# EAGLE design ADC3_60M (EAGLE 9.6.2)
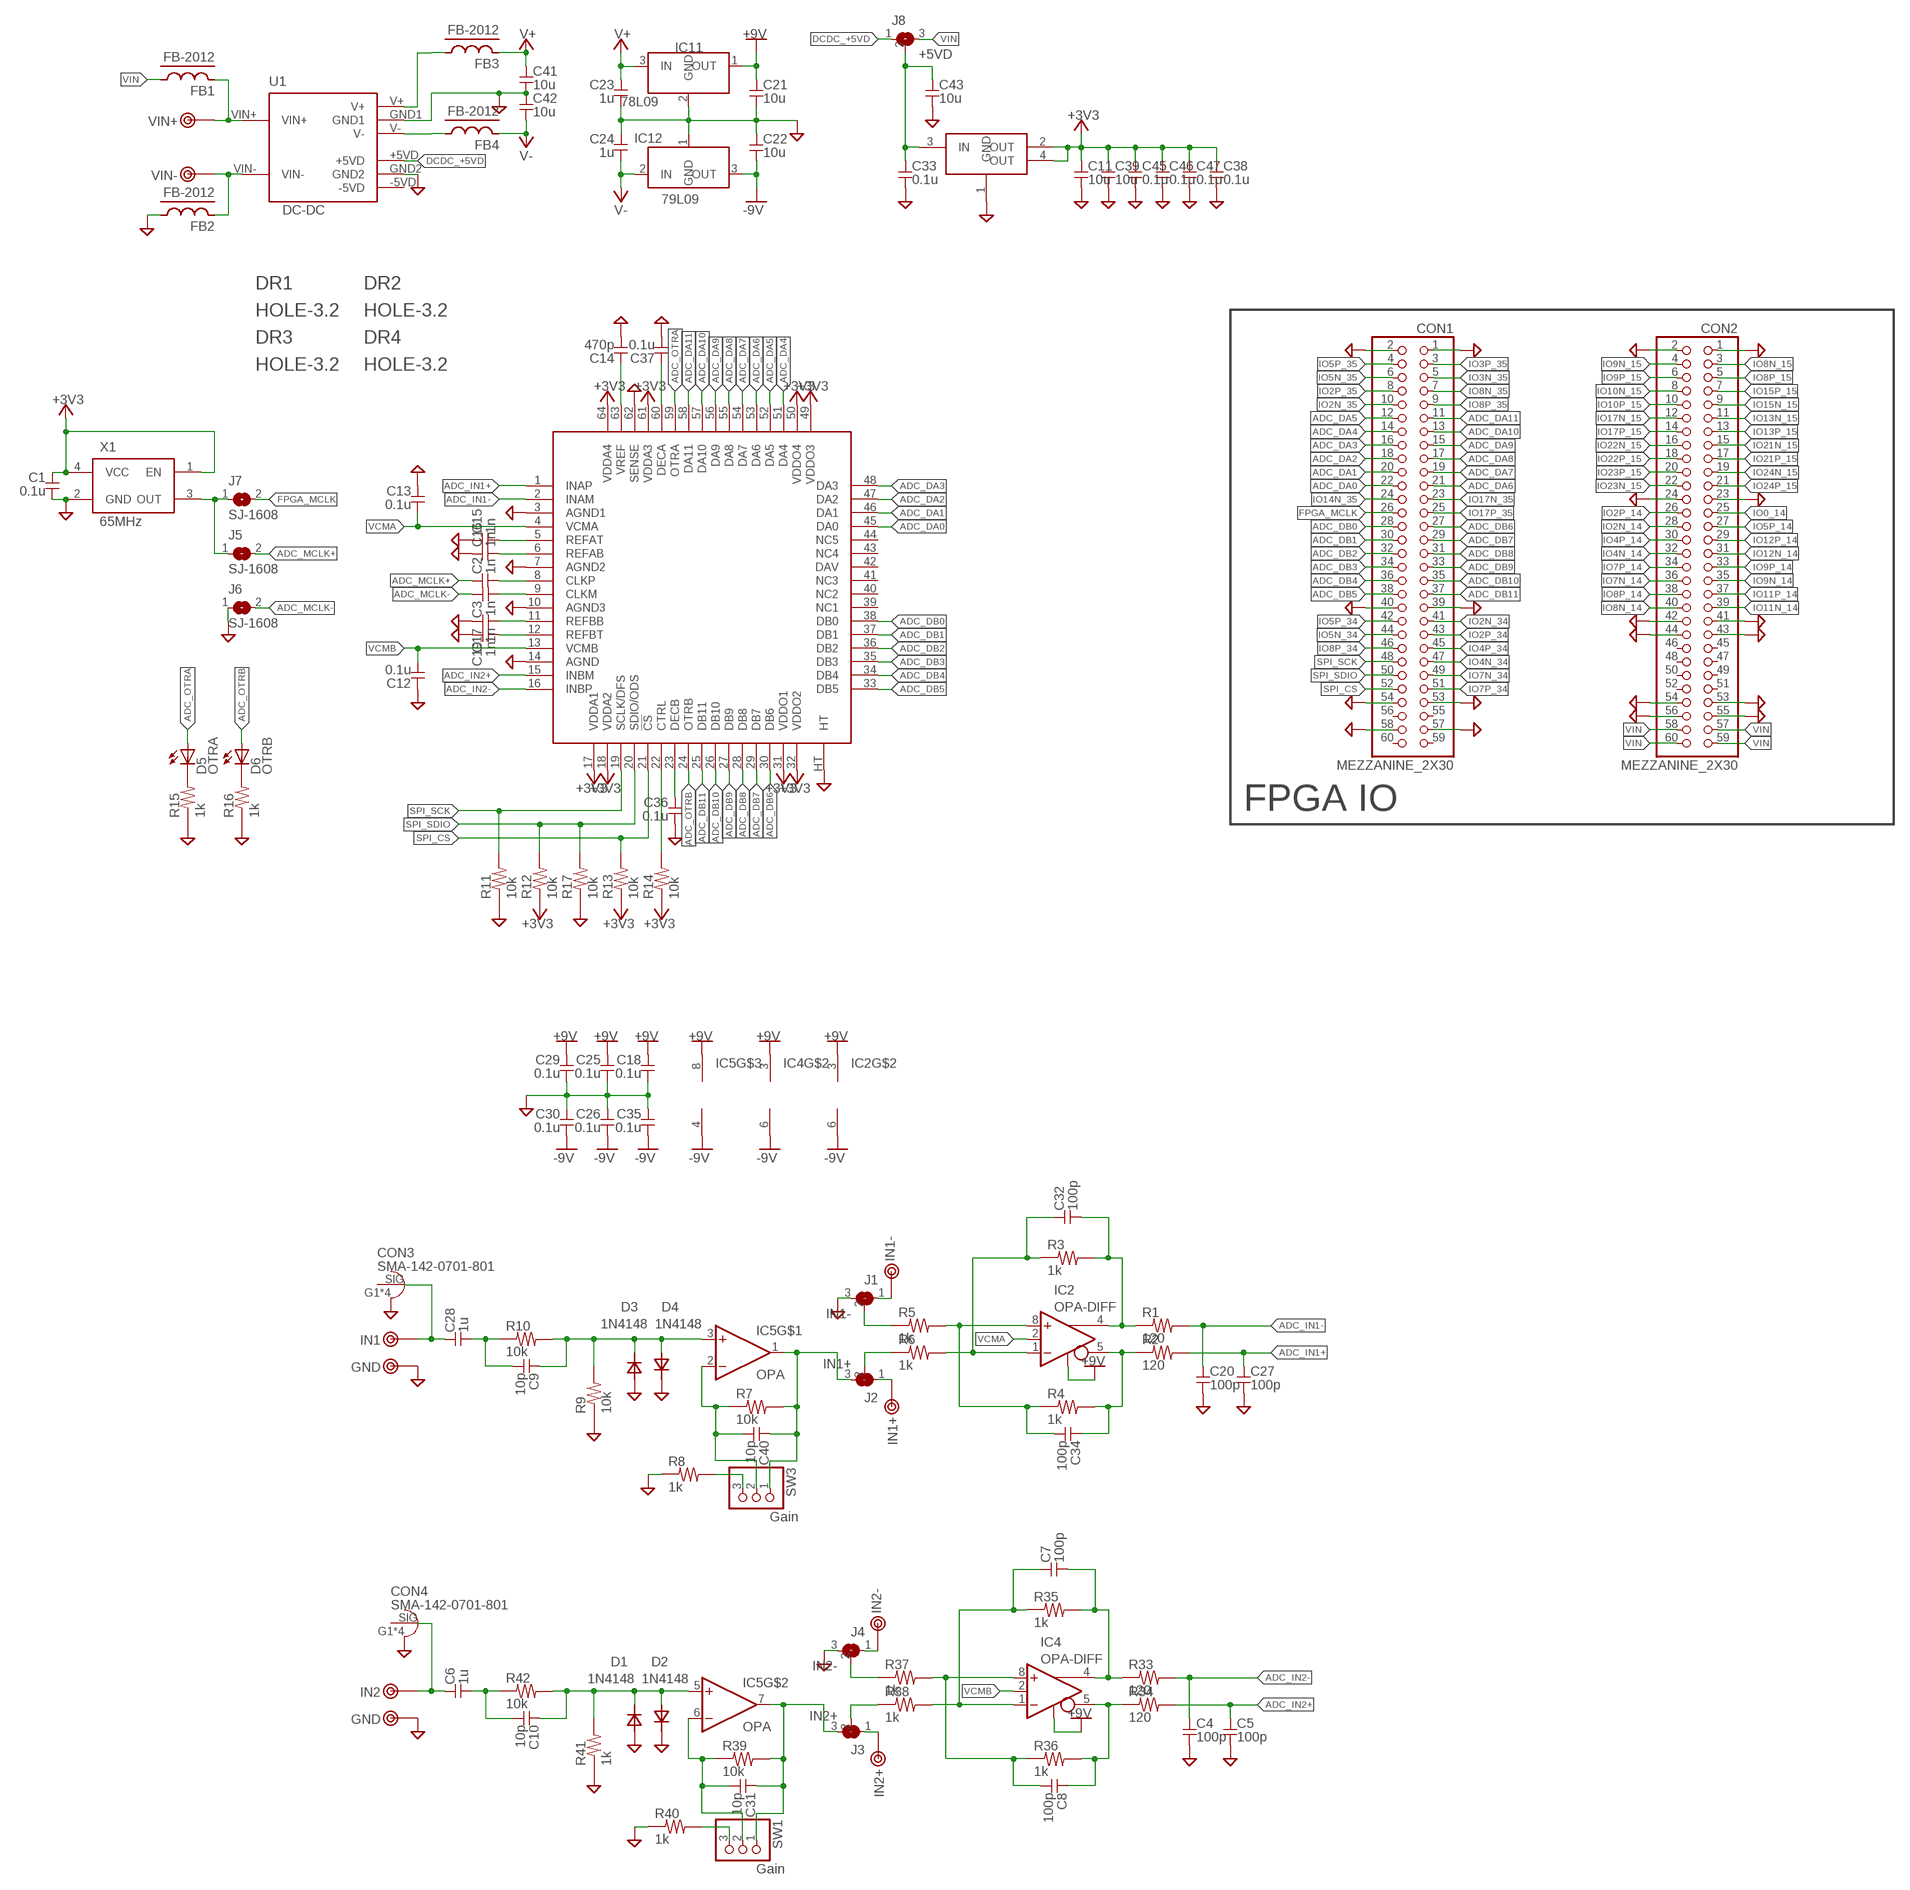
[diagram p0: schematic, sheet 1]

## Parts
C1  0.1u  C-1608  [1608]
C2  1n  C-1608  [1608]
C3  1n  C-1608  [1608]
C4  100p  C-1608  [1608]
C5  100p  C-1608  [1608]
C6  1u  C-5  [C050]
C7  100p  C-1608  [1608]
C8  100p  C-1608  [1608]
C9  10p  C-1608  [1608]
C10  10p  C-1608  [1608]
C11  10u  C-2012  [2012]
C12  0.1u  C-1608  [1608]
C13  0.1u  C-1608  [1608]
C14  470p  C-1608  [1608]
C15  1n  C-1608  [1608]
C16  1n  C-1608  [1608]
C17  1n  C-1608  [1608]
C18  0.1u  C-1608  [1608]
C19  1n  C-1608  [1608]
C20  100p  C-1608  [1608]
C21  10u  C-2012  [2012]
C22  10u  C-2012  [2012]
C23  1u  C-1608  [1608]
C24  1u  C-1608  [1608]
C25  0.1u  C-1608  [1608]
C26  0.1u  C-1608  [1608]
C27  100p  C-1608  [1608]
C28  1u  C-5  [C050]
C29  0.1u  C-1608  [1608]
C30  0.1u  C-1608  [1608]
C31  10p  C-1608  [1608]
C32  100p  C-1608  [1608]
C33  0.1u  C-1608  [1608]
C34  100p  C-1608  [1608]
C35  0.1u  C-1608  [1608]
C36  0.1u  C-1608  [1608]
C37  0.1u  C-1608  [1608]
C38  0.1u  C-1608  [1608]
C39  10u  C-2012  [2012]
C40  10p  C-1608  [1608]
C41  10u  C-3216  [3216]
C42  10u  C-3216  [3216]
C43  10u  C-2012  [2012]
C45  0.1u  C-1608  [1608]
C46  0.1u  C-1608  [1608]
C47  0.1u  C-1608  [1608]
CON1  MEZZANINE_2X30  [MEZZANINE_0.8MM_2X30]
CON2  MEZZANINE_2X30  [MEZZANINE_0.8MM_2X30]
CON3  SMA-142-0701-801  [SMA-EDGE]
CON4  SMA-142-0701-801  [SMA-EDGE]
D1  1N4148  DIODE-1N4148W  [SOD123]
D2  1N4148  DIODE-1N4148W  [SOD123]
D3  1N4148  DIODE-1N4148W  [SOD123]
D4  1N4148  DIODE-1N4148W  [SOD123]
D5  OTRA  LED-SMD1608  [D1608]
D6  OTRB  LED-SMD1608  [D1608]
DR1  HOLE-3.2  [HOLE_3.2]
DR2  HOLE-3.2  [HOLE_3.2]
DR3  HOLE-3.2  [HOLE_3.2]
DR4  HOLE-3.2  [HOLE_3.2]
FB1  FB-2012  [2012-J]
FB2  FB-2012  [2012-J]
FB3  FB-2012  [2012-J]
FB4  FB-2012  [2012-J]
IC1  ADC1212  [QFN64HT]
IC2  OPA-DIFF  [SOP8]
IC4  OPA-DIFF  [SOP8]
IC5  OPA  OPA-2-SOP  [SOP8]
IC7  AZ1086H-3.3  [SOT223]
IC11  78L09  78LX  [TO-92]
IC12  79L09  79LX  [TO-92]
J1  IN1-  SJ-3-1608  [1608-3-J]
J2  IN1+  SJ-3-1608  [1608-3-J]
J3  IN2+  SJ-3-1608  [1608-3-J]
J4  IN2-  SJ-3-1608  [1608-3-J]
J5  SJ-1608  [1608-J]
J6  SJ-1608  [1608-J]
J7  SJ-1608  [1608-J]
J8  +5VD  SJ-3-2012  [2012-3-J]
R1  120  R-1608  [1608]
R2  120  R-1608  [1608]
R3  1k  R-1608  [1608]
R4  1k  R-1608  [1608]
R5  1k  R-1608  [1608]
R6  1k  R-1608  [1608]
R7  10k  R-1608  [1608]
R8  1k  R-1608  [1608]
R9  10k  R-1608  [1608]
R10  10k  R-1608  [1608]
R11  10k  R-1608  [1608]
R12  10k  R-1608  [1608]
R13  10k  R-1608  [1608]
R14  10k  R-1608  [1608]
R15  1k  R-1608  [1608]
R16  1k  R-1608  [1608]
R17  10k  R-1608  [1608]
R33  120  R-1608  [1608]
R34  120  R-1608  [1608]
R35  1k  R-1608  [1608]
R36  1k  R-1608  [1608]
R37  1k  R-1608  [1608]
R38  1k  R-1608  [1608]
R39  10k  R-1608  [1608]
R40  1k  R-1608  [1608]
R41  1k  R-1608  [1608]
R42  10k  R-1608  [1608]
SW1  Gain  SW-1X3  [1X03]
SW3  Gain  SW-1X3  [1X03]
TP1  IN2  TESTPIN  [TESTPIN]
TP2  GND  TESTPIN  [TESTPIN]
TP3  IN2-  TESTPIN  [TESTPIN]
TP4  IN1  TESTPIN  [TESTPIN]
TP5  GND  TESTPIN  [TESTPIN]
TP6  IN2+  TESTPIN  [TESTPIN]
TP7  IN1-  TESTPIN  [TESTPIN]
TP8  IN1+  TESTPIN  [TESTPIN]
TP30  VIN+  TESTPIN  [TESTPIN]
TP31  VIN-  TESTPIN  [TESTPIN]
U1  DC-DC  [DCDC]
X1  65MHz  OSC-KC3225  [KC3225]

## Nets
+3V3: C1.1 C11.1 C38.1 C39.1 C45.1 C46.1 C47.1 IC1.17(VDDA1) IC1.18(VDDA2) IC1.31(VDDO1) IC1.32(VDDO2) IC1.49(VDDO3) IC1.50(VDDO4) IC1.61(VDDA3) IC1.64(VDDA4) IC7.2(OUT) IC7.4(OUT) R12.1 R13.1 R14.1 X1.1(EN) X1.4(VCC)
+9V: C18.1 C21.1 C25.1 C29.1 IC2.3(V+) IC2.7(EN) IC4.3(V+) IC4.7(EN) IC5.8(V+) IC11.1(OUT)
-9V: C22.2 C26.2 C30.2 C35.2 IC2.6(V-) IC4.6(V-) IC5.4(V-) IC12.3(OUT)
ADC_DA0: CON1.22 IC1.45(DA0)
ADC_DA1: CON1.20 IC1.46(DA1)
ADC_DA2: CON1.18 IC1.47(DA2)
ADC_DA3: CON1.16 IC1.48(DA3)
ADC_DA4: CON1.14 IC1.51(DA4)
ADC_DA5: CON1.12 IC1.52(DA5)
ADC_DA6: CON1.21 IC1.53(DA6)
ADC_DA7: CON1.19 IC1.54(DA7)
ADC_DA8: CON1.17 IC1.55(DA8)
ADC_DA9: CON1.15 IC1.56(DA9)
ADC_DA10: CON1.13 IC1.57(DA10)
ADC_DA11: CON1.11 IC1.58(DA11)
ADC_DB0: CON1.28 IC1.38(DB0)
ADC_DB1: CON1.30 IC1.37(DB1)
ADC_DB2: CON1.32 IC1.36(DB2)
ADC_DB3: CON1.34 IC1.35(DB3)
ADC_DB4: CON1.36 IC1.34(DB4)
ADC_DB5: CON1.38 IC1.33(DB5)
ADC_DB6: CON1.27 IC1.30(DB6)
ADC_DB7: CON1.29 IC1.29(DB7)
ADC_DB8: CON1.31 IC1.28(DB8)
ADC_DB9: CON1.33 IC1.27(DB9)
ADC_DB10: CON1.35 IC1.26(DB10)
ADC_DB11: CON1.37 IC1.25(DB11)
ADC_IN1+: C27.1 IC1.1(INAP) R2.2
ADC_IN1-: C20.1 IC1.2(INAM) R1.2
ADC_IN2+: C5.1 IC1.15(INBM) R34.2
ADC_IN2-: C4.1 IC1.16(INBP) R33.2
ADC_MCLK+: C2.1 J5.2
ADC_MCLK-: C3.1 J6.2
ADC_OTRA: D5.A IC1.59(OTRA)
ADC_OTRB: D6.A IC1.24(OTRB)
DCDC_+5VD: J8.1 U1.+5VD
FPGA_MCLK: CON1.26 J7.2
GND: C1.2 C4.2 C5.2 C11.2 C12.1 C13.1 C14.2 C15.1 C16.1 C17.1 C18.2 C19.1 C20.2 C21.2 C22.1 C23.2 C24.1 C25.2 C26.1 C27.2 C29.2 C30.1 C33.2 C35.1 C36.2 C37.2 C38.2 C39.2 C41.2 C42.1 C43.2 C45.2 C46.2 C47.2 CON1.1 CON1.2 CON1.39 CON1.40 CON1.53 CON1.54 CON1.57 CON1.58 CON2.1 CON2.2 CON2.23 CON2.24 CON2.41 CON2.42 CON2.43 CON2.44 CON2.53 CON2.54 CON2.55 CON2.56 CON3.G1(GND) CON3.G2(GND) CON3.G3(GND) CON3.G4(GND) CON4.G1(GND) CON4.G2(GND) CON4.G3(GND) CON4.G4(GND) D1.1(A) D2.2(K) D3.1(A) D4.2(K) FB2.1 IC1.3(AGND1) IC1.7(AGND2) IC1.10(AGND3) IC1.14(AGND) IC1.62(SENSE) IC1.HT IC7.1(GND) IC11.2(GND) IC12.1(GND) J1.3 J4.3 J6.1 R8.1 R9.1 R11.1 R15.1 R16.1 R17.1 R40.1 R41.1 TP2.1 TP5.1 U1.GND1 U1.GND2 X1.2(GND)
IO0_14: CON2.25
IO2N_14: CON2.28
IO2N_34: CON1.41
IO2N_35: CON1.10
IO2P_14: CON2.26
IO2P_34: CON1.43
IO2P_35: CON1.8
IO3N_35: CON1.5
IO3P_35: CON1.3
IO4N_14: CON2.32
IO4N_34: CON1.47
IO4P_14: CON2.30
IO4P_34: CON1.45
IO5N_34: CON1.44
IO5N_35: CON1.6
IO5P_14: CON2.27
IO5P_34: CON1.42
IO5P_35: CON1.4
IO7N_14: CON2.36
IO7N_34: CON1.49
IO7P_14: CON2.34
IO7P_34: CON1.51
IO8N_14: CON2.40
IO8N_15: CON2.3
IO8N_35: CON1.7
IO8P_14: CON2.38
IO8P_15: CON2.5
IO8P_34: CON1.46
IO8P_35: CON1.9
IO9N_14: CON2.35
IO9N_15: CON2.4
IO9P_14: CON2.33
IO9P_15: CON2.6
IO10N_15: CON2.8
IO10P_15: CON2.10
IO11N_14: CON2.39
IO11P_14: CON2.37
IO12N_14: CON2.31
IO12P_14: CON2.29
IO13N_15: CON2.11
IO13P_15: CON2.13
IO14N_35: CON1.24
IO15N_15: CON2.9
IO15P_15: CON2.7
IO17N_15: CON2.12
IO17N_35: CON1.23
IO17P_15: CON2.14
IO17P_35: CON1.25
IO21N_15: CON2.15
IO21P_15: CON2.17
IO22N_15: CON2.16
IO22P_15: CON2.18
IO23N_15: CON2.22
IO23P_15: CON2.20
IO24N_15: CON2.19
IO24P_15: CON2.21
MCLK: J5.1 J7.1 X1.3(OUT)
N$1: C7.2 IC4.4(+OUT) R33.1 R35.2
N$2: C8.1 IC4.5(-OUT) R34.1 R36.2
N$3: C8.2 IC4.8(+IN) R36.1 R37.2
N$4: R40.2 SW1.3
N$5: C3.2 IC1.9(CLKM)
N$6: C2.2 IC1.8(CLKP)
N$7: C14.1 IC1.63(VREF)
N$8: C17.2 IC1.11(REFBB)
N$9: C19.2 IC1.12(REFBT)
N$10: C15.2 IC1.5(REFAT)
N$11: C16.2 IC1.6(REFAB)
N$12: C7.1 IC4.1(-IN) R35.1 R38.2
N$13: C32.2 IC2.4(+OUT) R1.1 R3.2
N$14: C34.1 IC2.5(-OUT) R2.1 R4.2
N$15: J3.1 TP6.1
N$16: C31.2 IC5.6(-IN) R39.1 SW1.2
N$17: C34.2 IC2.8(+IN) R4.1 R5.2
N$18: C32.1 IC2.1(-IN) R3.1 R6.2
N$19: C40.1 IC5.1(OUT) J2.3 R7.2 SW3.1
N$20: C40.2 IC5.2(-IN) R7.1 SW3.2
N$21: C6.1 CON4.SIG TP1.1
N$22: C9.2 C28.2 R10.1
N$23: C9.1 D3.2(K) D4.1(A) IC5.3(+IN) R9.2 R10.2
N$24: R8.2 SW3.3
N$25: J1.2 R5.1
N$26: J2.2 R6.1
N$27: J3.2 R38.1
N$28: C28.1 CON3.SIG TP4.1
N$29: J4.2 R37.1
N$30: C31.1 IC5.7(OUT) J3.3 R39.2 SW1.1
N$31: J4.1 TP3.1
N$32: J2.1 TP8.1
N$33: J1.1 TP7.1
N$34: C33.1 C43.1 IC7.3(IN) J8.2
N$35: C6.2 C10.2 R42.1
N$37: C10.1 D1.2(K) D2.1(A) IC5.5(+IN) R41.2 R42.2
N$38: C37.1 IC1.60(DECA)
N$39: D6.K R16.2
N$40: D5.K R15.2
N$41: IC1.22(CTRL) R14.2
N$42: C36.1 IC1.23(DECB)
N$75: FB1.2 TP30.1 U1.VIN+
N$76: FB2.2 TP31.1 U1.VIN-
SPI_CS: CON1.52 IC1.21(!CS) R13.2
SPI_SCK: CON1.48 IC1.19(SCLK/DFS) R11.2
SPI_SDIO: CON1.50 IC1.20(SDIO/ODS) R12.2 R17.2
V+: C23.1 C41.1 FB3.2 IC11.3(IN)
V+_DCDC: FB3.1 U1.V+
V-: C24.2 C42.2 FB4.2 IC12.2(IN)
V-_DCDC: FB4.1 U1.V-
VCMA: C13.2 IC1.4(VCMA) IC2.2(CM)
VCMB: C12.2 IC1.13(VCMB) IC4.2(CM)
VIN: CON2.57 CON2.58 CON2.59 CON2.60 FB1.1 J8.3
Unconnected: CON1.55 CON1.56 CON1.59 CON1.60 CON2.45 CON2.46 CON2.47 CON2.48 CON2.49 CON2.50 CON2.51 CON2.52 IC1.39(NC1) IC1.40(NC2) IC1.41(NC3) IC1.42(DAV) IC1.43(NC4) IC1.44(NC5) U1.-5VD

## Notes on the sheet
- FPGA IO

## Library data of the parts
C1-C43 C45-C47 = my_rcl:C
CON1 CON2 = my_connector:MEZZANINE_2X30
CON3 CON4 = my_connector:SMA
D1-D4 = my_rcl:DIODE
D5 D6 = my_rcl:LED
DR1-DR4 = my_connector:HOLE-3.2
FB1-FB4 = my_rcl:FB
IC1 = my_ic:ADC1212
IC2 IC4 = my_ic:OPA-DIFF
IC5 = my_ic:OPA-2
IC7 = my_ic:AZ1086?-*
IC11 = my_ic:78LX
IC12 = my_ic:79LX
J1-J4 J8 = my_rcl:SJ-3
J5-J7 = my_rcl:SJ
R1-R17 R33-R42 = my_rcl:R
SW1 SW3 = my_connector:SW-1X3: PIN HEADER
TP1-TP8 TP30 TP31 = my_connector:TESTPIN
U1 = my_ic:DC-DC
X1 = my_rcl:OSC

## Board
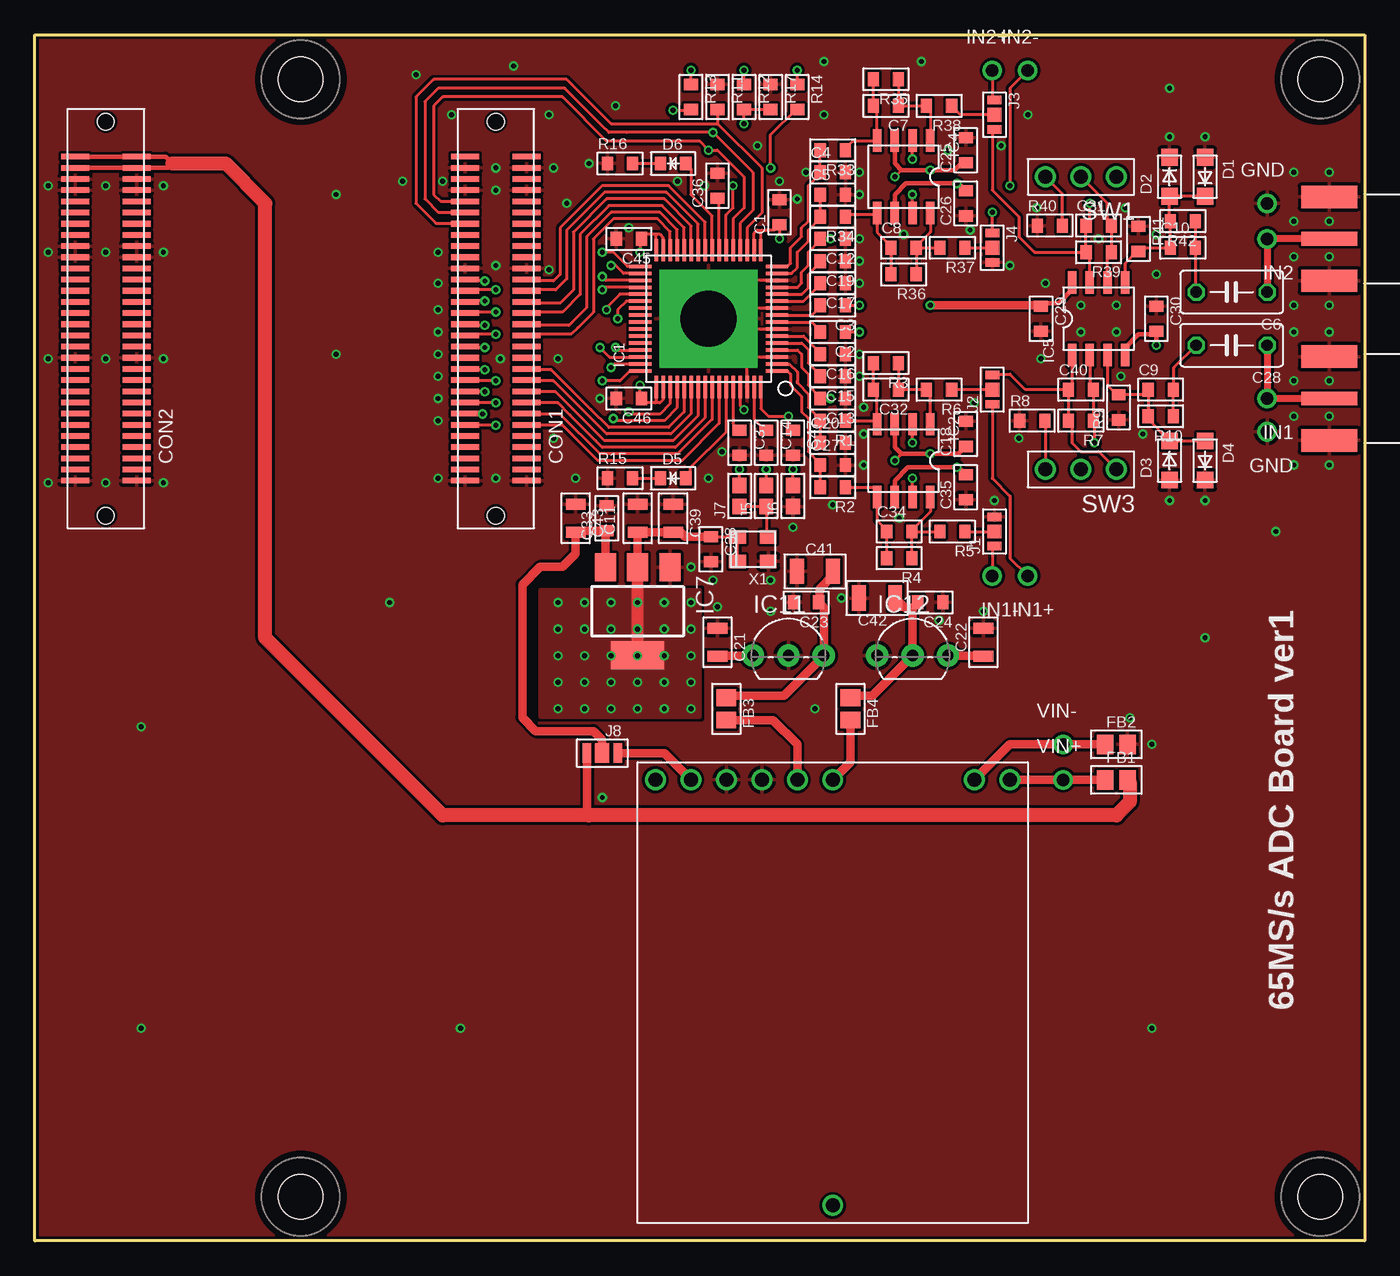
[diagram p1: board, top side]
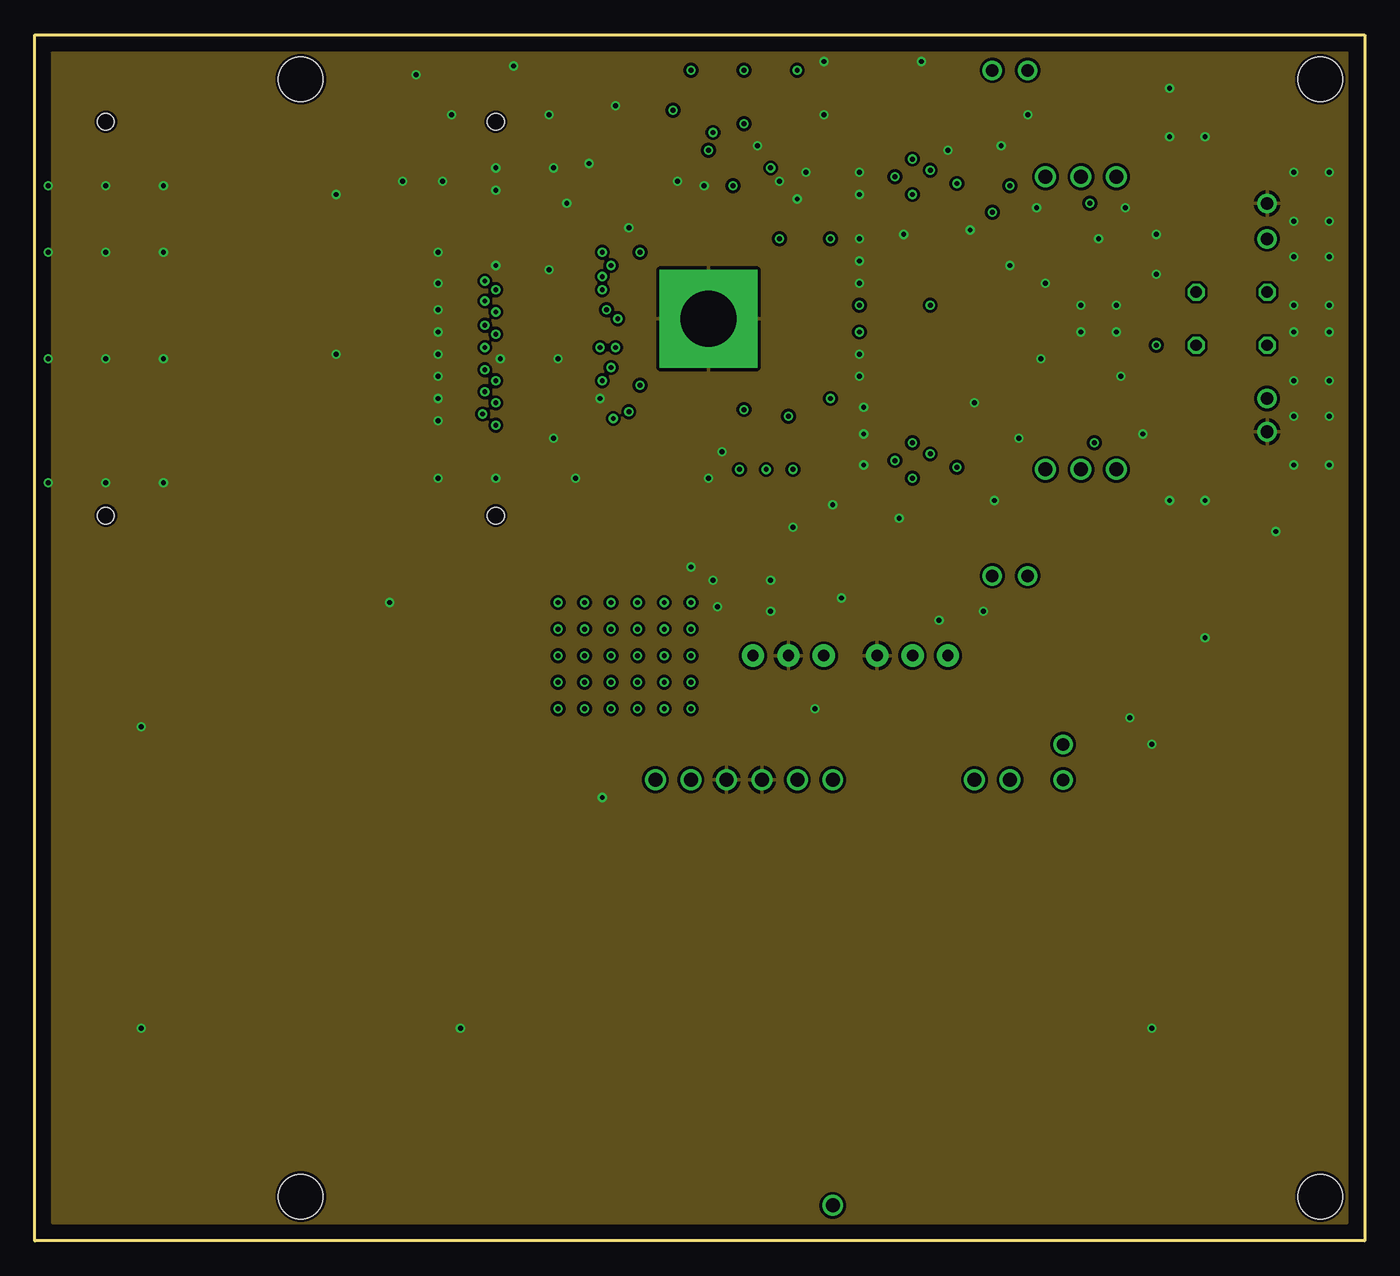
[diagram p2: board, inner layer Route2]
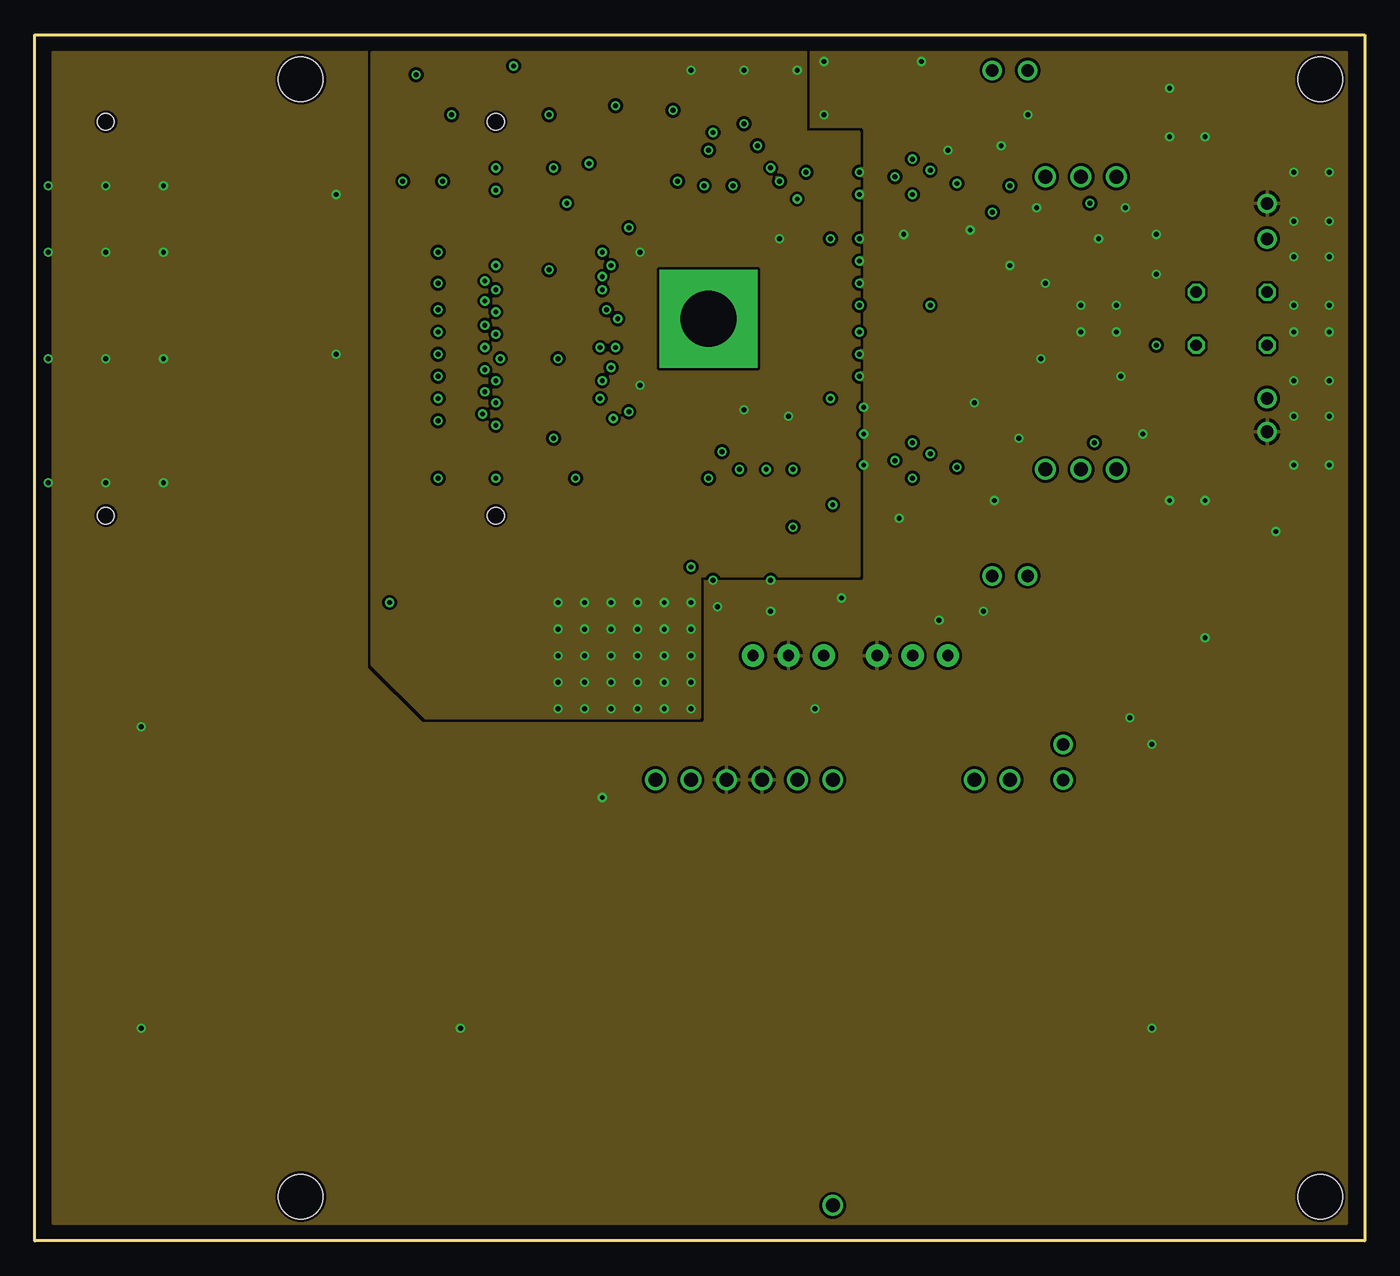
[diagram p3: board, inner layer Route15]
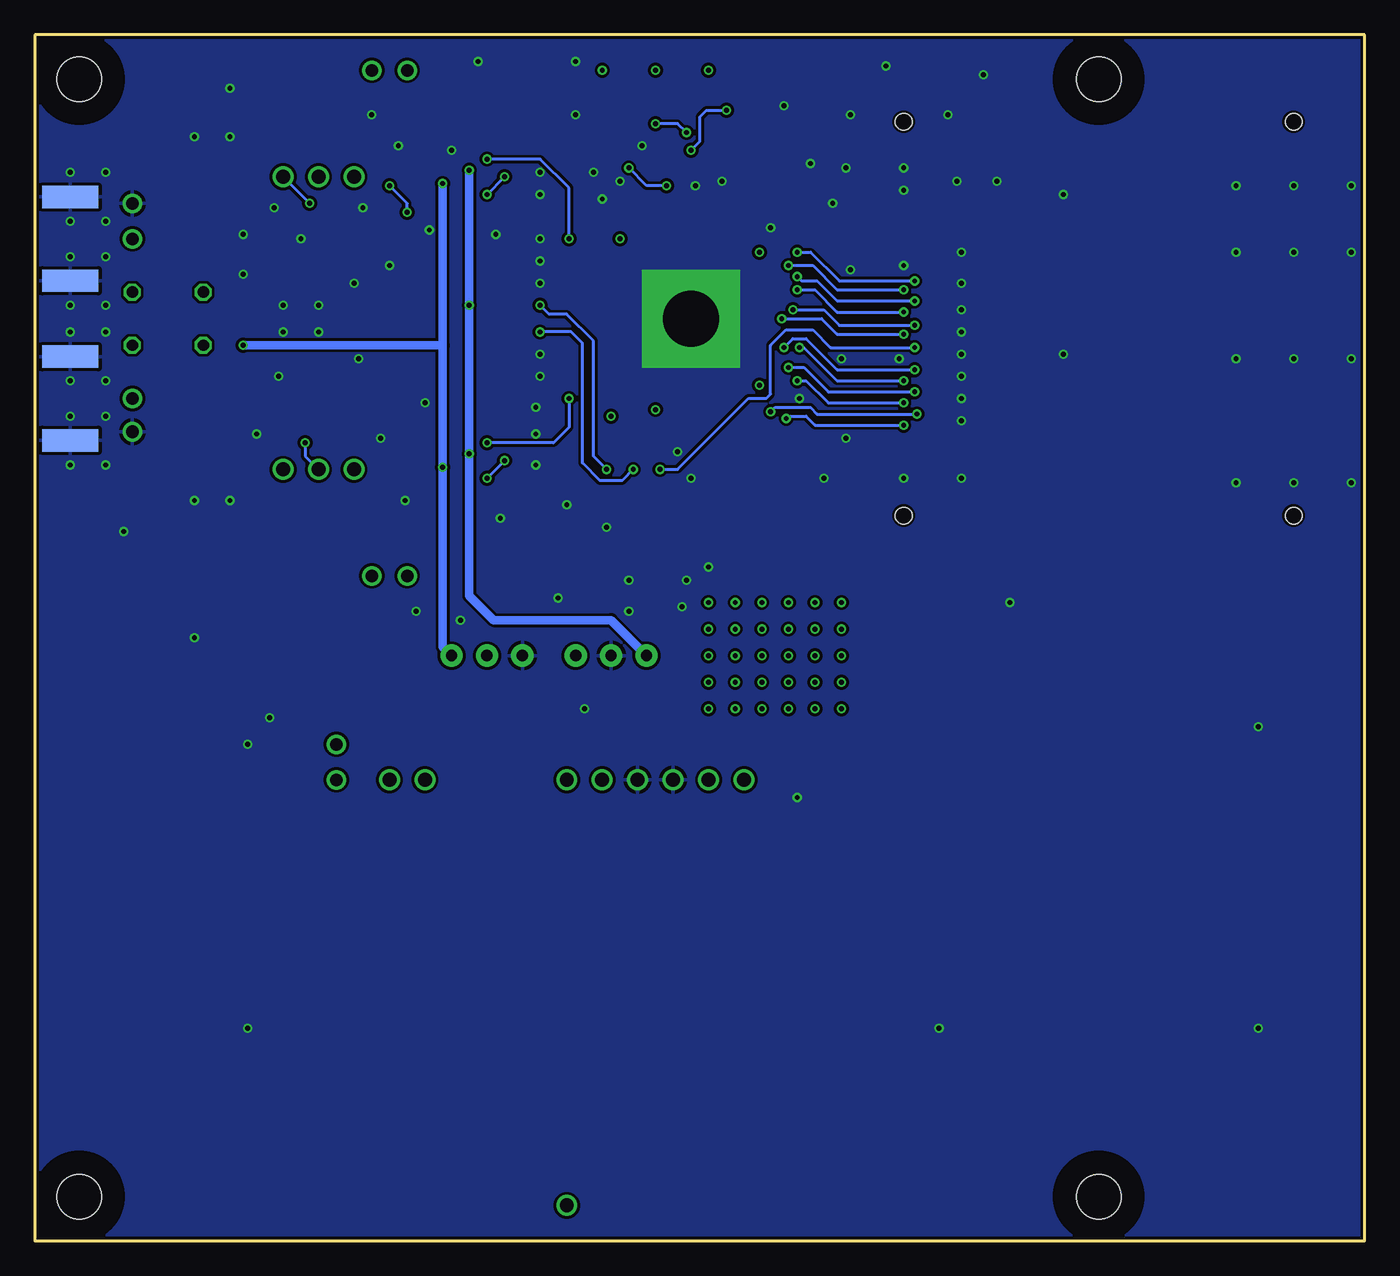
[diagram p4: board, bottom side, seen from below]

Size 95.25 x 86.36 mm. Coordinates in mm from the lower left corner, seen from the top.
Outline: 95.25,86.36 95.25,0 0,0 0,86.36 95.25,86.36
Copper layers (1*2*15*16): Top 0.035mm / dielectric 0.2mm / Route2 0.0175mm / dielectric 1.065mm / Route15 0.0175mm / dielectric 0.2mm / Bottom 0.035mm
Design rules "JLCPCB_4layer": minimum track width 6mil, minimum drill 0.3mm, track to track 6mil, track to pad 6mil, pad to pad 6mil, via to via 8mil, smd to smd 0mil, copper to edge 0.2mm, drill to drill 0.4mm, minimum pad ring 8mil, minimum via ring 6mil, stop-mask expansion 4mil, vias tented up to drill 1mm, thermal gap 10mil

### Footprints (pad centres in the part's own frame; a part is rotated, then mirrored left to right if it is on the bottom)
1608 = smd 0.8 x 1: 1 -0.9,0; 2 0.9,0
C050 = drill 0.813 octagon: 1 -2.54,0; 2 2.54,0
2012 = smd 0.8 x 1.4: 1 -1,0; 2 1,0
3216 = smd 1 x 1.8: 1 -1.3,0; 2 1.3,0
MEZZANINE_0.8MM_2X30 = smd 0.4 x 2: 1 -11.6,-2.2; 2 -11.6,2.2; 3 -10.8,-2.2; 4 -10.8,2.2; 5 -10,-2.2; 6 -10,2.2; 7 -9.2,-2.2; 8 -9.2,2.2; 9 -8.4,-2.2; 10 -8.4,2.2; 11 -7.6,-2.2; 12 -7.6,2.2; 13 -6.8,-2.2; 14 -6.8,2.2; 15 -6,-2.2; 16 -6,2.2; 17 -5.2,-2.2; 18 -5.2,2.2; 19 -4.4,-2.2; 20 -4.4,2.2; 21 -3.6,-2.2; 22 -3.6,2.2; 23 -2.8,-2.2; 24 -2.8,2.2; 25 -2,-2.2; 26 -2,2.2; 27 -1.2,-2.2; 28 -1.2,2.2; 29 -0.4,-2.2; 30 -0.4,2.2; 31 0.4,-2.2; 32 0.4,2.2; 33 1.2,-2.2; 34 1.2,2.2; 35 2,-2.2; 36 2,2.2; 37 2.8,-2.2; 38 2.8,2.2; 39 3.6,-2.2; 40 3.6,2.2; 41 4.4,-2.2; 42 4.4,2.2; 43 5.2,-2.2; 44 5.2,2.2; 45 6,-2.2; 46 6,2.2; 47 6.8,-2.2; 48 6.8,2.2; 49 7.6,-2.2; 50 7.6,2.2; 51 8.4,-2.2; 52 8.4,2.2; 53 9.2,-2.2; 54 9.2,2.2; 55 10,-2.2; 56 10,2.2; 57 10.8,-2.2; 58 10.8,2.2; 59 11.6,-2.2; 60 11.6,2.2 | hole 1.2: -14.1,0; 14.1,0
SMA-EDGE = smd 1.6 x 4: G1 -3,0; G2 3,0 | smd 1.6 x 4 bottom: G3 -3,0; G4 3,0 | smd 1 x 4: SIG 0,0
SOD123 = smd 1.2 x 1.2: 1 -1.4,0; 2 1.4,0
D1608 = smd 0.8 x 1: A 0.9,0; K -0.9,0
HOLE_3.2 = hole 3.2: 0,0
2012-J = smd 1.2 x 1.4: 1 -0.8,0; 2 0.8,0
QFN64HT = smd 0.25 x 1.6: 1 -3.75,-4.9; 2 -3.25,-4.9; 3 -2.75,-4.9; 4 -2.25,-4.9; 5 -1.75,-4.9; 6 -1.25,-4.9; 7 -0.75,-4.9; 8 -0.25,-4.9; 9 0.25,-4.9; 10 0.75,-4.9; 11 1.25,-4.9; 12 1.75,-4.9; 13 2.25,-4.9; 14 2.75,-4.9; 15 3.25,-4.9; 16 3.75,-4.9; 33 3.75,4.9; 34 3.25,4.9; 35 2.75,4.9; 36 2.25,4.9; 37 1.75,4.9; 38 1.25,4.9; 39 0.75,4.9; 40 0.25,4.9; 41 -0.25,4.9; 42 -0.75,4.9; 43 -1.25,4.9; 44 -1.75,4.9; 45 -2.25,4.9; 46 -2.75,4.9; 47 -3.25,4.9; 48 -3.75,4.9 | smd 1.6 x 0.25: 17 4.9,-3.75; 18 4.9,-3.25; 19 4.9,-2.75; 20 4.9,-2.25; 21 4.9,-1.75; 22 4.9,-1.25; 23 4.9,-0.75; 24 4.9,-0.25; 25 4.9,0.25; 26 4.9,0.75; 27 4.9,1.25; 28 4.9,1.75; 29 4.9,2.25; 30 4.9,2.75; 31 4.9,3.25; 32 4.9,3.75; 49 -4.9,3.75; 50 -4.9,3.25; 51 -4.9,2.75; 52 -4.9,2.25; 53 -4.9,1.75; 54 -4.9,1.25; 55 -4.9,0.75; 56 -4.9,0.25; 57 -4.9,-0.25; 58 -4.9,-0.75; 59 -4.9,-1.25; 60 -4.9,-1.75; 61 -4.9,-2.25; 62 -4.9,-2.75; 63 -4.9,-3.25; 64 -4.9,-3.75 | drill 4 pad 7 square: HT 0,0
SOP8 = smd 0.6 x 1.6: 1 -1.905,-2.6; 2 -0.635,-2.6; 3 0.635,-2.6; 4 1.905,-2.6; 5 1.905,2.6; 6 0.635,2.6; 7 -0.635,2.6; 8 -1.905,2.6
SOT223 = smd 1.5 x 2: 1 -2.3,-3.15; 2 0,-3.15; 3 2.3,-3.15 | smd 3.8 x 2: 4 0,3.15
TO-92 = drill 0.813 pad 1.6: 1 -2.54,0; 2 0,0; 3 2.54,0
1608-3-J = smd 0.6 x 1: 1 -1.05,0; 3 1.05,0 | smd 1 x 1: 2 0,0
1608-J = smd 1.1 x 1: 1 -0.75,0; 2 0.75,0
2012-3-J = smd 0.6 x 1.4: 1 -1.1,0; 3 1.1,0 | smd 1 x 1.4: 2 0,0
1X03 = drill 1: 1 -2.54,0; 2 0,0; 3 2.54,0
TESTPIN = drill 0.9 pad 1.4: 1 0,0
DCDC = drill 1: +5VD 10.16,0; -5VD 12.7,0; GND1 5.08,0; GND2 7.62,0; NC 0,30.48; V+ 2.54,0; V- 0,0; VIN+ -12.7,0; VIN- -10.16,0
KC3225 = smd 1.2 x 0.95: 1 -1.1,-0.875; 2 1.1,-0.875; 3 1.1,0.875; 4 -1.1,0.875

### Placement (x,y rotation side)
C1  53.34,73.66 90 top
C2  57.15,65.09 180 top
C3  57.15,66.99 180 top
C4  57.15,76.52 0 top
C5  57.15,74.93 0 top
C6  85.72,67.94 180 top
C7  60.96,81.28 180 top
C8  62.23,71.12 0 top
C9  80.64,60.96 0 top
C10  82.23,71.12 0 top
C11  43.18,51.75 90 top
C12  57.15,71.75 180 top
C13  57.15,60.33 180 top
C14  52.39,57.15 270 top
C15  57.15,61.91 180 top
C16  57.15,63.5 180 top
C17  57.15,68.58 180 top
C18  66.67,57.79 90 top
C19  57.15,70.17 180 top
C20  57.15,57.15 0 top
C21  48.9,42.86 90 top
C22  67.94,42.86 270 top
C23  55.24,45.72 180 top
C24  64.13,45.72 180 top
C25  66.67,78.11 90 top
C26  66.67,74.3 90 top
C27  57.15,55.56 0 top
C28  85.72,64.14 180 top
C29  72.07,66.04 270 top
C30  80.33,66.04 270 top
C31  76.2,72.71 0 top
C32  60.96,60.96 180 top
C33  40.96,51.75 90 top
C34  61.91,50.8 0 top
C35  66.67,53.98 90 top
C36  48.9,75.56 90 top
C37  50.48,57.15 270 top
C38  48.42,49.53 270 top
C39  45.72,51.75 90 top
C40  74.93,60.96 0 top
C41  55.88,47.94 180 top
C42  60.33,46.04 0 top
C43  38.73,51.75 90 top
C45  42.55,71.75 180 top
C46  42.55,60.33 180 top
C47  54.29,57.15 270 top
CON1  33.02,66.04 90 top
CON2  5.08,66.04 90 top
CON3  92.71,60.33 270 top
CON4  92.71,71.75 270 top
D1  83.82,76.2 270 top
D2  81.28,76.2 90 top
D3  81.28,55.88 90 top
D4  83.82,55.88 270 top
D5  45.72,54.61 0 top
D6  45.72,77.15 0 top
DR1  19.05,3.18 0 top
DR2  92.08,3.18 0 top
DR3  19.05,83.19 0 top
DR4  92.08,83.19 0 top
FB1  77.47,33.02 180 top
FB2  77.47,35.56 180 top
FB3  49.53,38.1 90 top
FB4  58.42,38.1 90 top
IC1  48.26,66.04 90 top
IC2  62.23,55.88 180 top
IC4  62.23,76.2 180 top
IC5  76.2,66.04 0 top
IC7  43.18,45.09 180 top
IC11  53.98,41.91 0 top
IC12  62.87,41.91 0 top
J1  68.74,50.8 90 top
J2  68.58,60.96 90 top
J3  68.74,80.65 270 top
J4  68.58,71.12 270 top
J5  52.39,53.34 90 top
J6  54.29,53.34 90 top
J7  50.48,53.34 90 top
J8  40.64,34.93 180 top
R1  57.15,58.74 180 top
R2  57.15,53.98 180 top
R3  60.96,62.87 180 top
R4  61.91,48.9 180 top
R5  65.72,50.8 180 top
R6  64.77,60.96 180 top
R7  74.93,58.74 180 top
R8  71.44,58.74 0 top
R9  77.63,59.69 90 top
R10  80.64,59.06 180 top
R11  48.9,81.92 270 top
R12  50.8,81.92 270 top
R13  46.99,81.92 270 top
R14  54.61,81.92 270 top
R15  41.91,54.61 0 top
R16  41.91,77.15 0 top
R17  52.7,81.92 270 top
R33  57.15,78.11 180 top
R34  57.15,73.34 180 top
R35  60.96,83.19 180 top
R36  62.23,69.22 180 top
R37  65.72,71.12 180 top
R38  64.77,81.28 180 top
R39  76.2,70.8 180 top
R40  72.71,72.71 0 top
R41  79.06,71.75 270 top
R42  82.23,73.03 180 top
SW1  74.93,76.2 180 top
SW3  74.93,55.25 180 top
TP1  88.27,71.75 180 top
TP2  88.27,57.94 180 top
TP3  71.12,83.82 0 top
TP4  88.27,60.33 180 top
TP5  88.27,74.3 0 top
TP6  68.58,83.82 0 top
TP7  68.58,47.62 180 top
TP8  71.12,47.62 180 top
TP30  73.66,33.02 0 top
TP31  73.66,35.56 0 top
U1  57.15,33.02 180 top
X1  51.44,49.53 0 top

### Tracks (layer width: path | path; a pad name or v marks a point on that pad's centre or on a via)
+3V3  (via drill 0.35)
  Top 0.203: IC1.18 51.51,72.15 51.75,72.39 52.07,72.39 | 52.07,72.39 52.39,72.39 52.97,72.39 C1.1 v53.34,71.75 | IC1.17 52.01,72.33 52.07,72.39 | IC1.61 50.51,59.82 v50.8,59.53 | IC1.31 45.01,71.83 44.77,72.07 44.45,72.07 | 44.45,72.07 43.76,72.07 C45.1 43.34,71.65 v43.34,70.8 | IC1.32 44.51,72.01 44.45,72.07 | IC1.50 45.01,60.25 44.77,60.01 44.45,60.01 | 44.45,60.01 43.76,60.01 C46.1 43.34,60.43 v43.34,61.28 | IC1.49 44.51,60.07 44.45,60.01 | X1.1 X1.4 48.44,50.41 C38.1 | R12.1 v50.8,83.82 | R13.1 v46.99,83.82 | C47.1 53.98,58.37 v53.98,59.06 52.55,59.06 52.01,59.59 IC1.64 | R14.1 v54.61,83.82
  Top 0.61: IC7.2 C11.1 C39.1 46.24,50.75 46.57,50.43 C38.1
  Top 0.813: IC7.2 IC7.4
  other vias: 39.37,45.72 41.27,45.72 43.18,45.72 45.09,45.72 46.99,45.72 46.99,43.82 45.09,43.82 43.18,43.82 41.27,43.82 39.37,43.82 39.37,41.91 41.27,41.91 43.18,41.91 45.09,41.91 46.99,41.91 39.37,40.01 41.27,40.01 43.18,40.01 45.09,40.01 46.99,40.01 39.37,38.1 41.27,38.1 43.18,38.1 45.09,38.1 46.99,38.1 37.47,45.72 37.47,43.82 37.47,41.91 37.47,40.01 37.47,38.1
  pour Top (isolate 0.203, no thermals): 47.62,37.47 36.2,37.47 36.2,46.67 47.62,46.67
  pour Route15 (isolate 0.203, rank 2): 55.24,85.09 24.13,85.09 24.13,41.28 27.94,37.47 47.62,37.47 47.62,47.62 59.05,47.62 59.05,79.38 55.24,79.38
+9V  (via drill 0.35)
  Top 0.203: IC2.7 v62.87,54.61 | v61.59,55.88 61.91,56.2 | 61.91,56.2 61.99,56.28 | IC4.7 v62.87,74.93 | v61.59,76.2 62.07,76.68 | 61.99,56.44 61.99,56.28 | 61.99,56.28 61.91,56.2
  Top 0.305: IC2.3 61.59,56.83 61.99,56.44 62.07,56.36 v64.13,56.36 65.88,56.36 66.15,56.36 C18.1 | IC4.3 61.59,77.15 62.07,76.68 v64.13,76.68 65.88,76.68 66.41,77.21 C25.1 | IC5.8 74.3,68.1 73.34,67.15 72.28,67.15 C29.1
  Top 0.61: C29.1 72.02,66.99 v64.13,66.99 | C21.1 48.94,41.91 IC11.1
  Bottom 0.203: v62.87,54.61 v61.59,55.88 | v62.87,74.93 v61.59,76.2
  Bottom 0.61: v64.13,76.68 v64.13,66.99 v64.13,56.36 64.13,46.2 62.39,44.45 53.98,44.45 IC11.1
-9V  (via drill 0.35)
  Top 0.305: IC2.6 61.59,54.45 62.55,55.4 64.13,55.4 v66.04,55.4 66.15,55.4 C35.2 | IC4.6 61.59,74.93 62.39,75.72 63.02,75.72 64.13,75.72 v66.04,75.72 66.15,75.72 C26.2 | IC5.4 78.11,63.98 79.06,64.93 80.12,64.93 C30.2 v80.33,64.14
  Top 0.61: C22.2 67.9,41.91 IC12.3
  Bottom 0.61: 66.04,64.14 v66.04,55.4 66.04,42.55 IC12.3 | 66.04,64.14 v66.04,75.72 | 66.04,64.14 v80.33,64.14
ADC_DA0  (via drill 0.35)
  Top 0.203: v41.59,63.98 41.78,63.79 IC1.45 | v32.23,62.39 30.87,62.39 CON1.22
  Bottom 0.203: v41.59,63.98 40.96,64.61 40,64.61 37.78,62.39 v32.23,62.39
ADC_DA1  (via drill 0.35)
  Top 0.203: IC1.46 41.17,63.29 v40.48,63.98 | v33.02,61.59 30.87,61.59 CON1.20
  Bottom 0.203: v33.02,61.59 37.78,61.59 40.16,63.98 v40.48,63.98
ADC_DA2  (via drill 0.35)
  Top 0.203: IC1.47 41.52,62.79 v41.27,62.55 | v32.23,60.8 30.86,60.8 CON1.18
  Bottom 0.203: v41.27,62.55 40.16,62.55 38.42,60.8 v32.23,60.8
ADC_DA3  (via drill 0.35)
  Top 0.203: IC1.48 42.61,62.29 41.91,61.59 v40.64,61.59 | CON1.16 30.85,60.01 v33.02,60.01
  Bottom 0.203: v40.64,61.59 40,61.59 38.42,60.01 v33.02,60.01
ADC_DA4  (via drill 0.35)
  Top 0.203: IC1.51 45.51,59.96 44.77,59.21 42.7,59.21 v42.55,59.37 | v32.07,59.21 30.85,59.21 CON1.14
  Bottom 0.203: v42.55,59.37 42.23,59.69 39.69,59.69 39.21,59.21 v32.07,59.21
ADC_DA5  (via drill 0.35)
  Top 0.203: IC1.52 46.01,59.66 45.09,58.74 41.59,58.74 v41.43,58.9 | v33.02,58.42 30.84,58.42 CON1.12
  Bottom 0.203: v41.43,58.9 41.27,59.06 40,59.06 39.37,58.42 v33.02,58.42
ADC_DA6
  Top 0.203: IC1.53 46.51,59.37 45.4,58.26 41.12,58.26 39.85,59.53 36.99,62.39 35.27,62.39 CON1.21
ADC_DA7
  Top 0.203: IC1.54 47.01,59.23 45.56,57.79 40.96,57.79 39.21,59.53 37.15,61.59 35.27,61.59 CON1.19
ADC_DA8
  Top 0.203: IC1.55 47.51,59.1 45.72,57.31 40.8,57.31 38.73,59.37 37.31,60.8 35.26,60.8 CON1.17
ADC_DA9
  Top 0.203: IC1.56 48.01,58.96 45.88,56.83 40.64,56.83 40.16,57.31 38.34,59.13 37.47,60.01 35.25,60.01 CON1.15
ADC_DA10
  Top 0.203: IC1.57 48.51,58.83 46.04,56.36 40.48,56.36 37.62,59.21 35.25,59.21 CON1.13
ADC_DA11
  Top 0.203: IC1.58 49.01,58.54 46.36,55.88 40.96,55.88 40.32,55.88 37.78,58.42 35.24,58.42 CON1.11
ADC_DB0  (via drill 0.35)
  Top 0.203: IC1.38 42.37,67.29 41.75,66.68 v41.75,66.04 | CON1.28 30.91,64.93 v33.02,64.93
  Bottom 0.203: v33.02,64.93 37.78,64.93 38.89,66.04 v41.75,66.04
ADC_DB1  (via drill 0.35)
  Top 0.203: IC1.37 41.91,67.79 40.96,66.83 v40.96,66.68 | CON1.30 30.9,65.56 v32.23,65.56
  Bottom 0.203: v40.96,66.68 38.73,66.68 37.62,65.56 v32.23,65.56
ADC_DB2  (via drill 0.35)
  Top 0.203: IC1.36 40.83,68.29 v40.64,68.1 | CON1.32 30.9,66.52 v33.02,66.52
  Bottom 0.203: v40.64,68.1 39.37,68.1 37.78,66.52 v33.02,66.52
ADC_DB3  (via drill 0.35)
  Top 0.203: IC1.35 40.91,68.79 v40.64,69.06 | CON1.34 30.89,67.31 v32.23,67.31
  Bottom 0.203: v40.64,69.06 40.32,68.74 39.21,68.74 37.78,67.31 v32.23,67.31
ADC_DB4  (via drill 0.35)
  Top 0.203: IC1.34 42.15,69.29 41.59,69.85 v41.27,69.85 | CON1.36 30.88,68.1 v33.02,68.1
  Bottom 0.203: v41.27,69.85 39.53,69.85 37.78,68.1 v33.02,68.1
ADC_DB5  (via drill 0.35)
  Top 0.203: IC1.33 42.45,69.79 41.43,70.8 v40.64,70.8 | v32.23,68.74 30.92,68.74 CON1.38
  Bottom 0.203: v40.64,70.8 40.48,70.8 v40.64,70.8 | v40.64,70.8 39.69,70.8 37.62,68.74 v32.23,68.74
ADC_DB6
  Top 0.203: IC1.30 45.51,72.28 44.61,73.18 41.43,73.18 40,71.75 40,66.52 38.89,65.41 38.42,64.93 35.88,64.93 35.72,64.77 35.29,64.77 CON1.27
ADC_DB7
  Top 0.203: IC1.29 46.01,72.42 44.77,73.66 41.27,73.66 39.53,71.91 39.53,66.83 38.26,65.56 35.3,65.56 CON1.29
ADC_DB8
  Top 0.203: IC1.28 46.51,72.55 44.93,74.14 41.12,74.14 39.05,72.07 39.05,67.79 37.78,66.52 35.3,66.52 CON1.31
ADC_DB9
  Top 0.203: IC1.27 47.01,72.69 45.09,74.61 40.96,74.61 38.58,72.23 38.58,68.1 38.18,67.71 37.62,67.15 35.31,67.15 CON1.33
ADC_DB10
  Top 0.203: IC1.26 47.51,72.82 45.24,75.09 40.8,75.09 38.1,72.39 38.1,69.53 38.1,68.9 37.31,68.1 35.28,68.1 CON1.35
ADC_DB11
  Top 0.203: IC1.25 48.01,72.96 45.4,75.56 40.64,75.56 37.62,72.55 37.62,69.69 37.62,69.22 37.15,68.74 35.32,68.74 CON1.37
ADC_IN1+
  Top 0.203: IC1.1 53.91,62.29 54.13,62.07 54.13,61.28 54.93,60.48 54.93,59.37 55.4,58.9 55.4,56.52 56.25,55.67 C27.1 R2.2
ADC_IN1-
  Top 0.203: IC1.2 54.05,62.79 54.61,62.23 54.61,61.59 | 54.61,61.59 54.61,61.44 | 54.61,61.44 54.61,61.59 | 54.61,61.44 55.4,60.64 55.4,59.69 56.25,58.84 R1.2 C20.1
ADC_IN2+
  Top 0.203: IC1.15 54.21,69.29 54.61,69.69 54.61,70.8 55.4,71.6 55.4,72.39 56.25,73.24 R34.2 C5.1
ADC_IN2-
  Top 0.203: IC1.16 53.91,69.79 54.13,70.01 54.13,71.12 54.93,71.91 54.93,72.55 55.4,73.03 55.4,75.56 56.25,76.41 C4.1 R33.2
ADC_MCLK+  (via drill 0.35)
  Top 0.203: C2.1 v59.05,65.09 | J5.2 v52.39,55.25
  Bottom 0.203: v52.39,55.25 53.18,54.45 54.77,54.45 56.04,55.72 56.04,64.29 56.83,65.09 v59.05,65.09
ADC_MCLK-  (via drill 0.35)
  Top 0.203: C3.1 v59.05,66.99 | J6.2 v54.29,55.25
  Bottom 0.203: v54.29,55.25 55.24,56.2 55.24,64.45 57.15,66.36 58.42,66.36 v59.05,66.99
ADC_OTRA
  Top 0.203: IC1.59 49.51,57.92 46.94,55.35 46.94,54.93 D5.A
ADC_OTRB
  Top 0.203: IC1.24 48.51,73.41 47.15,74.77 46.99,74.93 46.99,76.78 D6.A
DCDC_+5VD
  Top 0.61: U1.+5VD 45.09,34.93 J8.1
FPGA_MCLK  (via drill 0.35)
  Top 0.203: J7.2 v50.48,55.25 | v32.23,63.98 30.88,63.98 CON1.26
  Bottom 0.203: v50.48,55.25 49.21,55.25 44.13,60.33 42.86,60.33 42.55,60.64 42.55,64.14 41.43,65.25 39.53,65.25 38.26,63.98 v32.23,63.98
GND  (via drill 0.35)
  Top 0.203: IC1.62 51.01,63.29 | 51.01,63.29 48.9,65.41 | 48.9,65.41 IC1.HT 49.01,66.79 | IC1.3 51.01,63.29 | IC1.7 49.01,65.29 48.9,65.41 | IC1.10 49.01,66.79 | IC1.14 51.01,68.79 49.01,66.79
  other vias: 42.55,72.55 40.48,60.33 47.94,75.56 39.69,77.15 37.47,63.18 38.73,54.61 46.99,48.26 48.58,47.31 52.7,47.31 52.7,45.09 48.9,45.4 40.64,31.75 80.01,35.56 78.42,37.47 64.77,44.45 67.94,45.09 61.91,51.75 59.37,57.79 59.37,55.56 59.37,59.69 59.05,61.91 59.05,63.5 59.05,68.58 59.05,70.17 59.05,71.75 59.05,74.93 59.05,76.52 55.24,76.52 54.61,74.61 57.15,52.7 54.29,51.12 49.21,56.52 48.26,54.61 37.15,57.47 33.34,63.18 33.02,69.85 36.83,69.53 38.1,74.3 46.04,75.88 51.75,78.42 53.34,75.88 37.15,76.84 33.02,76.84 33.02,75.25 33.02,54.61 5.08,54.29 9.21,54.29 0.95,54.29 5.08,63.18 0.95,63.18 9.21,63.18 5.08,70.8 0.95,70.8 9.21,70.8 0.95,75.56 5.08,75.56 9.21,75.56 28.89,54.61 28.89,58.74 28.89,60.33 28.89,61.91 28.89,63.5 28.89,65.09 28.89,66.68 28.89,68.58 28.89,70.8 29.21,75.88 26.35,75.88 29.84,80.65 27.3,83.5 34.29,84.14 36.83,80.65 41.59,81.28 56.52,80.65 62.23,72.07 65.41,78.11 66.99,72.39 69.22,78.42 71.12,80.65 71.75,73.98 69.85,69.85 76.2,71.75 80.33,72.07 77.47,66.99 74.93,66.99 74.93,65.09 77.47,65.09 79.38,57.79 70.48,57.47 67.31,60.01 68.74,53.02 57.79,46.04 55.88,38.1 81.28,53.02 83.82,53.02 81.28,79.06 83.82,79.06 72.07,63.18 80.33,69.22 77.79,61.91 78.11,73.98 72.39,68.58 92.71,70.49 92.71,66.99 90.17,70.49 90.17,66.99 92.71,73.03 90.17,73.03 90.17,76.52 92.71,76.52 92.71,65.09 90.17,65.09 90.17,61.59 92.71,61.59 92.71,59.06 90.17,59.06 90.17,55.56 92.71,55.56 63.5,84.46 81.28,82.55 88.9,50.8 83.82,43.18 80.01,15.24 30.48,15.24 7.62,15.24 7.62,36.83 25.4,45.72 21.59,63.5 21.59,74.93 56.52,84.46
  pour Top (isolate 0.203, rank 4): 0,86.36 95.25,86.36 95.25,0 0,0
  pour Bottom (isolate 0.203, rank 4): 0,86.36 95.25,86.36 95.25,0 0,0
  pour Route2 (isolate 0.203, rank 4): 1.27,85.09 93.98,85.09 93.98,1.27 1.27,1.27
  pour Route15 (isolate 0.203, rank 4): 1.27,85.09 1.27,1.27 93.98,1.27 93.98,85.09
  pour Bottom (isolate 0.203, rank 4, no thermals): 44.13,70.17 44.13,61.91 52.39,61.91 52.39,70.17
MCLK
  Top 0.203: X1.3 52.39,50.55 J5.1 J7.1
N$1
  Top 0.203: R33.1 58.05,78.21 58.58,78.74 60.27,78.74 IC4.4 60.33,81.02 C7.2 R35.2
N$2
  Top 0.203: R34.1 58.21,73.5 60.23,73.5 IC4.5 60.33,72.23 61.33,71.23 C8.1 R36.2
N$3
  Top 0.203: C8.2 R36.1 | C8.2 R37.2 | IC4.8 64.13,72.23 63.13,71.23 C8.2
N$4
  Top 0.203: R40.2 73.61,74.98 SW1.3
N$5
  Top 0.203: IC1.9 55.65,66.29 56.25,66.89 C3.2
N$6
  Top 0.203: IC1.8 55.65,65.79 56.25,65.19 C2.2
N$7
  Top 0.203: IC1.63 51.51,58.82 52.28,58.05 C14.1
N$8
  Top 0.203: IC1.11 55.07,67.29 56.25,68.47 C17.2
N$9
  Top 0.203: IC1.12 54.93,67.79 55.4,68.26 55.4,69.22 56.25,70.06 C19.2
N$10
  Top 0.203: IC1.5 54.93,64.29 55.4,63.82 55.4,62.87 56.25,62.02 C15.2
N$11
  Top 0.203: IC1.6 55.07,64.79 56.25,63.61 C16.2
N$12
  Top 0.203: R35.1 C7.1 R38.2 64.13,81.02 IC4.1
N$13
  Top 0.203: R1.1 60.07,58.74 IC2.4 60.33,60.7 C32.2 R3.2
N$14
  Top 0.203: R2.1 60.17,53.98 60.33,53.82 IC2.5 60.33,51.59 61.01,50.91 C34.1 R4.2
N$15
  Top 0.203: TP6.1 68.58,81.92 68.74,81.76 J3.1
N$16
  Top 0.203: IC5.6 76.83,70.54 R39.1 C31.2 76.83,72.97 76.83,74.3 SW1.2
N$17
  Top 0.203: R4.1 C34.2 63.02,50.8 | 63.02,50.8 R5.2 | IC2.8 64.13,52.23 63.02,51.12 63.02,50.8
N$18
  Top 0.203: R3.1 C32.1 R6.2 64.13,60.7 IC2.1
N$19
  Top 0.203: J2.3 68.64,62.07 69.85,62.07 70.96,60.96 C40.1 | C40.1 R7.2 74.3,58.47 74.3,57.15 74.93,56.52 76.2,56.52 SW3.1 | IC5.1 74.3,61.23 C40.1
N$20  (via drill 0.35)
  Top 0.203: IC5.2 75.56,61.23 C40.2 R7.1 75.88,58.69 v75.88,57.15
  Bottom 0.203: v75.88,57.15 75.88,56.2 SW3.2
N$21
  Top 0.203: 88.42,71.75 TP1.1 | 88.27,68.1 C6.1
  Top 0.508: CON4.SIG 88.42,71.75 | TP1.1 88.27,68.1
N$22
  Top 0.203: R10.1 C9.2 81.6,61.01 81.6,62.55 C28.2
N$23
  Top 0.203: IC5.3 76.83,61.28 77.52,60.59 R9.2 77.68,60.64 79.43,60.64 C9.1 79.75,59.69 | 79.75,59.69 R10.2 | 79.75,59.69 79.75,58.84 81.2,57.39 | D3.2 81.28,57.31 81.2,57.39 | D4.1 81.31,57.28 81.2,57.39
N$24
  Top 0.203: R8.2 72.39,58.69 SW3.3
N$25
  Top 0.203: R5.1 J1.2
N$26
  Top 0.203: J2.2 R6.1
N$27
  Top 0.203: J3.2 66.31,80.65 R38.1
N$28
  Top 0.508: C28.1 TP4.1 CON3.SIG
N$29
  Top 0.203: R37.1 J4.2
N$30  (via drill 0.35)
  Top 0.203: IC5.7 75.56,70.54 R39.2 | R39.2 C31.1 75.56,72.97 v75.56,74.3 | J3.3 68.58,79.44 68.58,75.25 70.48,73.34 70.48,71.91 71.6,70.8 R39.2
  Bottom 0.203: v75.56,74.3 SW1.1
N$31  (via drill 0.35)
  Top 0.203: J4.1 v68.58,73.66 | TP3.1 69.85,82.55 v69.85,75.56
  Bottom 0.203: v68.58,73.66 68.58,74.3 v69.85,75.56
N$32
  Top 0.203: J2.1 68.58,54.61 69.85,53.34 69.85,48.9 TP8.1
N$33
  Top 0.203: J1.1 68.64,49.75 68.58,49.69 TP7.1
N$34
  Top 0.61: IC7.3 40.88,50.78 C33.1 38.84,50.85 C43.1 38.73,49.21 37.78,48.26 36.2,48.26 34.92,46.99 34.92,37.47 35.88,36.51 40,36.51 40.64,35.88 J8.2
N$35
  Top 0.203: R42.1 C10.2 83.13,68 C6.2
N$37
  Top 0.203: IC5.5 78.11,70.01 78.95,70.86 R41.2 79.32,71.12 C10.1 R42.2 81.28,73.08 D2.1 D1.2
N$38
  Top 0.203: IC1.60 50.01,58.52 C37.1
N$39
  Top 0.203: R16.2 D6.K
N$40
  Top 0.203: R15.2 D5.K
N$41  (via drill 0.35)
  Top 0.203: IC1.22 49.51,73.48 50.01,73.98 v50.01,75.56 | v52.7,76.84 52.7,79.22 54.5,81.02 R14.2
  Bottom 0.203: v50.01,75.56 51.44,75.56 v52.7,76.84
N$42
  Top 0.203: IC1.23 49.01,74.55 C36.1
N$75
  Top 0.61: U1.VIN+ 73.34,33.02 | 73.34,33.02 TP30.1 | FB1.2 73.34,33.02
N$76
  Top 0.61: U1.VIN- 69.85,35.56 TP31.1 FB2.2
SPI_CS  (via drill 0.35)
  Top 0.203: IC1.21 50.01,73.18 50.8,73.97 50.8,76.2 48.9,78.11 v48.26,78.11 47.62,78.74 40.96,78.74 37.78,81.92 29.21,81.92 28.57,81.28 28.57,74.93 29.05,74.45 30.81,74.45 CON1.52 | R13.2 46.94,80.96 v45.72,80.96
  Bottom 0.203: v48.26,78.11 47.62,78.74 47.62,80.49 47.15,80.96 v45.72,80.96
SPI_SCK
  Top 0.203: IC1.19 51.01,72.55 52.07,73.61 52.07,76.84 48.9,80.01 | CON1.48 30.79,72.87 28.73,72.87 27.3,74.3 27.3,81.92 28.57,83.19 38.1,83.19 41.27,80.01 48.9,80.01 | R11.2 48.9,80.01
SPI_SDIO  (via drill 0.35)
  Top 0.203: IC1.20 50.51,72.87 51.44,73.79 51.44,76.52 v48.58,79.38 42.39,79.38 41.12,79.38 40.64,79.85 37.94,82.55 28.89,82.55 27.94,81.6 27.94,74.61 28.89,73.66 30.8,73.66 CON1.50 | v50.8,80.01 R12.2 R17.2
  Bottom 0.203: v48.58,79.38 49.21,80.01 v50.8,80.01
V+
  Top 0.61: C41.1 57.18,47.66 56.2,46.67 56.2,45.77 C23.1 56.52,45.35 IC11.3 53.66,39.05 49.68,39.05 FB3.2
V+_DCDC
  Top 0.61: U1.V+ 54.61,35.56 52.87,37.3 FB3.1
V-
  Top 0.61: 62.87,45.35 IC12.2 60.01,39.05 58.57,39.05 FB4.2 | 62.87,45.35 C24.2 | C42.2 62.31,45.35 62.87,45.35
V-_DCDC
  Top 0.61: FB4.1 58.42,34.29 U1.V-
VCMA  (via drill 0.35)
  Top 0.203: IC1.4 54.64,63.79 54.93,63.5 54.93,62.55 55.4,62.07 55.4,61.28 56.25,60.43 C13.2 v56.99,60.33 | v62.87,57.15 IC2.2
  Bottom 0.203: v56.99,60.33 56.99,58.26 58.1,57.15 v62.87,57.15
VCMB  (via drill 0.35)
  Top 0.203: IC1.13 54.64,68.29 54.93,68.58 54.93,69.37 55.4,69.85 55.4,70.8 56.25,71.65 C12.2 v56.99,71.75 | v62.87,77.47 IC4.2
  Bottom 0.203: v56.99,71.75 56.99,75.41 59.05,77.47 v62.87,77.47
VIN
  Top 0.305: CON2.60 CON2.59 9.36,77.64 9.84,77.15 9.53,76.84 CON2.57 CON2.58
  Top 0.61: J8.3 39.54,30.63 39.69,30.48
  Top 1.016: FB1.1 78.42,32.87 78.42,31.43 77.47,30.48 39.69,30.48 29.21,30.48 16.51,43.18 16.51,74.3 13.65,77.15 9.84,77.15

### Text on the board
tPlace: 65MS/s ADC Board ver1